# EAGLE schematic lipo_charger (EAGLE 6.6.0)
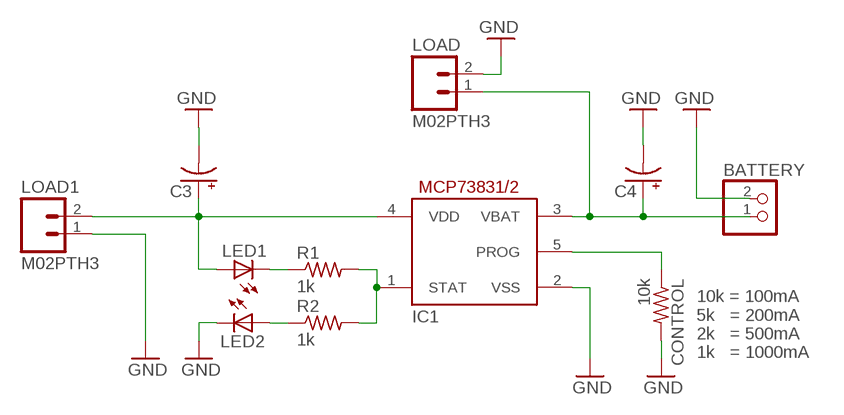
[diagram p0: schematic, sheet 1]

## Parts
BATTERY  JST_2PIN-SMT-RA  [JST-PH-2-SMT-RA]
C3  CAP_POL1206  [EIA3216]
C4  CAP_POL1206  [EIA3216]
CONTROL  10k  R-US_R0603  [R0603]
IC1  MCP73831/OT  [SOT23-5L]
LED1  LEDCHIPLED_0603  [CHIPLED_0603]
LED2  LEDCHIPLED_0603  [CHIPLED_0603]
LOAD  M02PTH3  [1X02_LONGPADS]
LOAD1  M02PTH3  [1X02_LONGPADS]
R1  1k  R-US_R0603  [R0603]
R2  1k  R-US_R0603  [R0603]

## Nets
GND: BATTERY.2 C3.C(-) C4.C(-) CONTROL.2 IC1.2(VSS) LED2.C LOAD1.1 LOAD.2
N$1: C3.A(+) IC1.4(VDD) LED1.A LOAD1.2
N$2: LED1.C R1.1
N$3: LED2.A R2.1
N$4: IC1.1(STAT) R1.2 R2.2
N$5: BATTERY.1 C4.A(+) IC1.3(VBAT) LOAD.1
N$6: CONTROL.1 IC1.5(PROG)

## Notes on the sheet
- 10k = 100mA
  5k   = 200mA
  2k   = 500mA
  1k   = 1000mA

## Library data of the parts
BATTERY = adafruit:JST_2PIN: JST 2-Pin Connectors of various flavors SMT-RA (S2B-PH-SM4) 4UConnector #17311 SMT (B2B-PH-SM4) THM-RA (S2B-PH) THM (B2B-PH)
C3 C4 = SparkFun-Capacitors:CAP_POL: Capacitor Polarized These are standard SMD and PTH capacitors. Normally 10uF, 47uF, and 100uF in electrolytic and tantalum varieties. Always verify the external diameter of the through hole cap, it varies with capacity, voltage, and manufacturer. The EIA devices should be standard.
CONTROL R1 R2 = adafruit:R-US_: RESISTOR, American symbol
IC1 = adafruit:MCP73831: MCP73831/2 Miniature Single-Cell, Fully Integrated Li-Ion, Li-Polymer Charge Management Controllers. Nice and small simple lipoly charge controller, with adjustable current and status output (LED) http://www.ladyada.net/library/pcb/eaglelibrary.html
LED1 LED2 = adafruit:LED: LED OSRAM: - CHIPLED LG R971, LG N971, LY N971, LG Q971, LY Q971, LO R971, LY R971 LH N974, LH R974 LS Q976, LO Q976, LY Q976 LO Q996 - Hyper CHIPLED LW Q18S LB Q993, LB Q99A, LB R99A - SideLED LS A670, LO A670, LY A670, LG A670, LP A670 LB A673, LV A673, LT A673, LW A673 LH A674 LY A675 LS A676, LA A676, LO A676, LY A676, LW A676 LS A679, LY A679, LG A679 - Hyper Micro SIDELED® LS Y876, LA Y876, LO Y876, LY Y876 LT Y87S - SmartLED LW L88C, LW L88S LB L89C, LB L89S, LG L890 LS L89K, LO L89K, LY L89K LS L896, LA L896, LO L896, LY L896 - TOPLED LS T670, LO T670, LY T670, LG T670, LP T670 LSG T670, LSP T670, LSY T670, LOP T670, LYG T670 LG T671, LOG T671, LSG T671 LB T673, LV T673, LT T673, LW T673 LH T674 LS T676, LA T676, LO T676, LY T676, LB T676, LH T676, LSB T676, LW T676 LB T67C, LV T67C, LT T67C, LS T67K, LO T67K, LY T67K, LW E67C LS E67B, LA E67B, LO E67B, LY E67B, LB E67C, LV E67C, LT E67C LW T67C LS T679, LY T679, LG T679 LS T770, LO T770, LY T770, LG T770, LP T770 LB T773, LV T773, LT T773, LW T773 LH T774 LS E675, LA E675, LY E675, LS T675 LS T776, LA T776, LO T776, LY T776, LB T776 LHGB T686 LT T68C, LB T68C - Hyper Mini TOPLED® LB M676 - Mini TOPLED Santana® LG M470 LS M47K, LO M47K, LY M47K Source: http://www.osram.convergy.de/
LOAD LOAD1 = SparkFun-Connectors:M02: Standard 2-pin 0.1" header. Use with - straight break away headers ( PRT-00116) - right angle break away headers (PRT-00553) - swiss pins (PRT-00743) - machine pins (PRT-00117) - female headers (PRT-00115) Molex polarized connector foot print use with: PRT-08233 with associated crimp pins and housings. 2.54_SCREWTERM for use with PRT-10571. 3.5mm Screw Terminal footprints for PRT-08084 5mm Screw Terminal footprints for use with PRT-08433